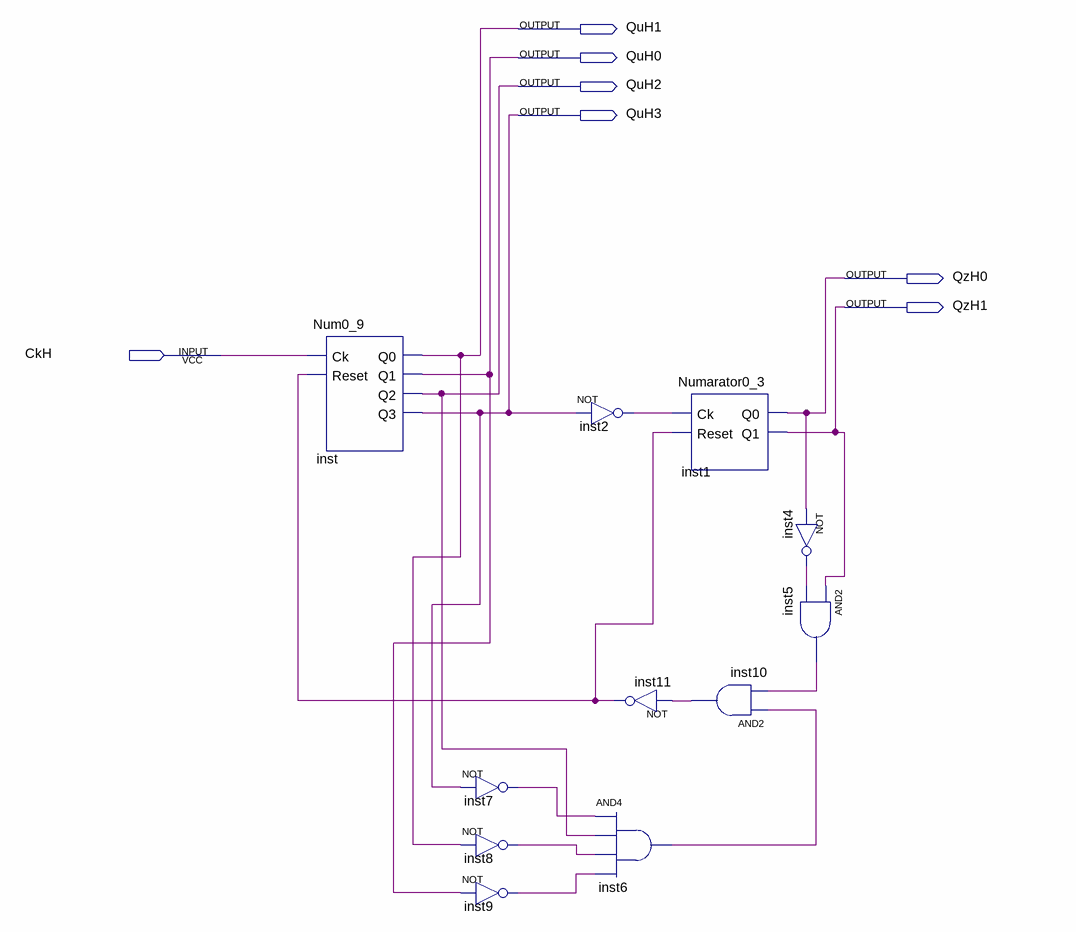
[diagram p0: schematic sheet]
// Quartus schematic NumH.bdf as structural Verilog: 11 symbols, 7 pins
module NumH (
  input  CkH,
  output QuH1,
  output QuH0,
  output QuH2,
  output QuH3,
  output QzH0,
  output QzH1
);

  wire inst2_out, inst4_out, inst5_out, inst6_out, inst7_out, inst8_out, inst9_out, inst10_out, inst11_out;

  Num0_9 inst (.Ck(CkH), .Reset(inst11_out), .Q0(QuH1), .Q1(QuH0), .Q2(QuH2), .Q3(QuH3));
  not inst7 (inst7_out, QuH3);
  not inst8 (inst8_out, QuH1);
  not inst9 (inst9_out, QuH0);
  not inst2 (inst2_out, QuH3);
  not inst11 (inst11_out, inst10_out);
  and inst6 (inst6_out, inst7_out, QuH2, inst8_out, inst9_out);
  Numarator0_3 inst1 (.Ck(inst2_out), .Reset(inst11_out), .Q0(QzH0), .Q1(QzH1));
  and inst10 (inst10_out, inst6_out, inst5_out);
  not inst4 (inst4_out, QzH0);
  and inst5 (inst5_out, QzH1, inst4_out);
endmodule
